# EAGLE design final (EAGLE 9.2.2)
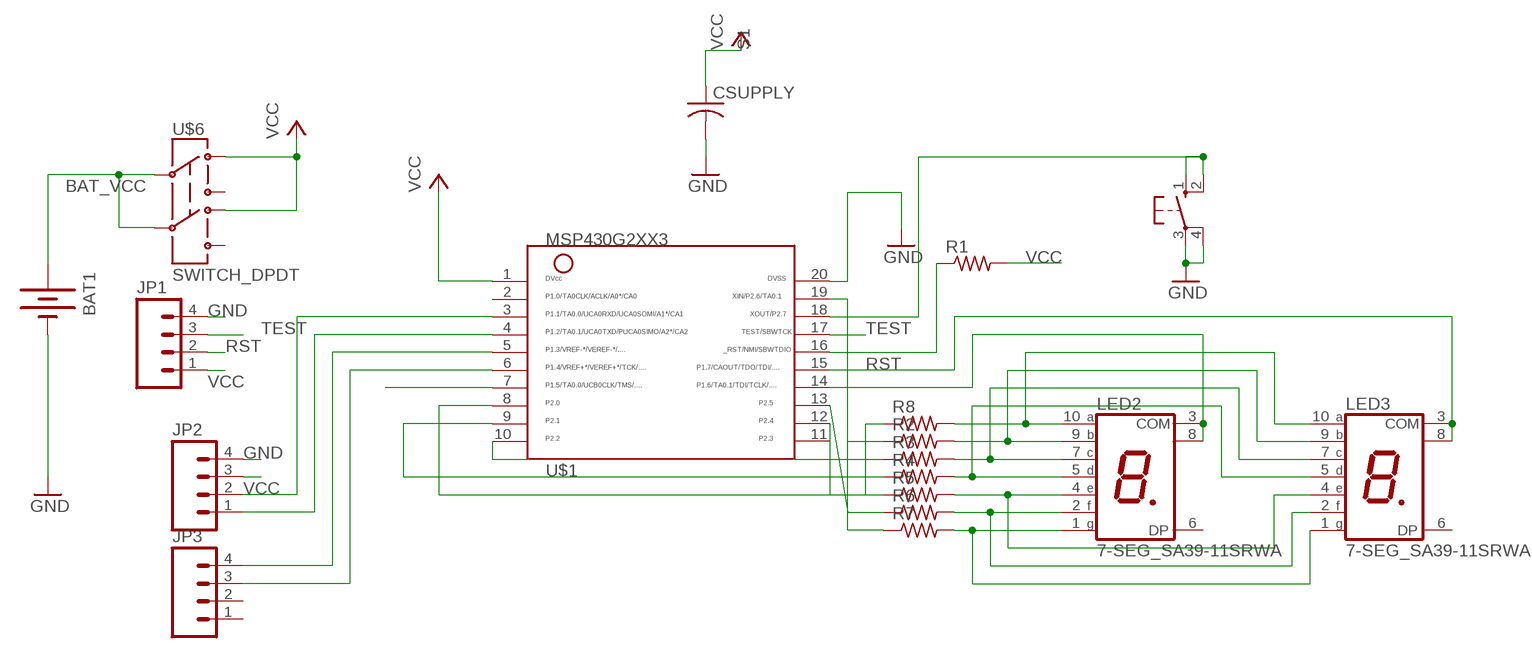
[diagram p0: schematic, sheet 1]

## Parts
BAT1  BATTERYBU2032SM  [BU2032SM]
CSUPPLY  C-USC1206  [C1206]
JP1  M04LOCK  [1X04_LOCK]
JP2  M04LOCK  [1X04_LOCK]
JP3  M04LOCK  [1X04_LOCK]
LED2  7-SEG_SA39-11SRWA  [SA39-11SRWA]
LED3  7-SEG_SA39-11SRWA  [SA39-11SRWA]
R1  R-US_R1206  [R1206]
R2  R-US_R1206  [R1206]
R3  R-US_R1206  [R1206]
R4  R-US_R1206  [R1206]
R5  R-US_R1206  [R1206]
R6  R-US_R1206  [R1206]
R7  R-US_R1206  [R1206]
R8  R-US_R1206  [R1206]
S1  10-XX  [B3F-10XX]
U$1  MSP430G2XX3TSSOP  [PW20]
U$6  SWITCH_DPDT  [JS_DPDT_TH]

## Nets
BAT_VCC: BAT1.P$1(+) U$6.2 U$6.5
GND: BAT1.P$2(-) CSUPPLY.2 JP1.4 JP2.4 S1.3(P) S1.4(P1) U$1.20
N$1: JP3.4 U$1.5
N$2: R8.1 U$1.8
N$5: R2.1 U$1.9
N$6: R3.1 U$1.10
N$7: R4.1 U$1.11
N$8: R5.1 U$1.12
N$9: R6.1 U$1.13
N$10: R7.1 U$1.19
N$11: LED2.3(COM) LED2.8(COM) U$1.14
N$12: LED2.10(A) LED3.10(A) R8.2
N$13: S1.1(S) S1.2(S1) U$1.18
N$14: LED2.9(B) LED3.9(B) R2.2
N$15: LED2.7(C) LED3.7(C) R3.2
N$16: LED2.5(D) LED3.5(D) R4.2
N$17: LED2.4(E) LED3.4(E) R5.2
N$18: LED2.2(F) LED3.2(F) R6.2
N$19: LED2.1(G) LED3.1(G) R7.2
N$20: LED3.3(COM) LED3.8(COM) U$1.15
N$27: JP2.2 U$1.3
N$28: JP2.1 U$1.4
N$29: JP3.3 U$1.6
N$31: U$1.7
RST: JP1.2 R1.1 U$1.16
TEST: JP1.3 U$1.17
VCC: CSUPPLY.1 JP1.1 JP2.3 R1.2 U$1.1 U$6.1 U$6.4
Unconnected: JP3.1 JP3.2 LED2.6(DP) LED3.6(DP) U$1.2 U$6.3 U$6.6

## Library data of the parts
BAT1 = ELEC327:BATTERY: Battery Holders Various common sizes : AA, AAA, 20mm coin cell and 12mm coin cell. 20MM_4LEGS, BATT-10373
CSUPPLY = rcl:C-US: CAPACITOR, American symbol
JP1-JP3 = SparkFun:M04: Header 4 Standard 4-pin 0.1" header. Use with straight break away headers (SKU : PRT-00116), right angle break away headers (PRT-00553), swiss pins (PRT-00743), machine pins (PRT-00117), and female headers (PRT-00115). Molex polarized connector foot print use with SKU : PRT-08231 with associated crimp pins and housings. 1MM SMD Version SKU: PRT-10208
LED2 LED3 = display-kingbright:7-SEG_: Kingbright 14.2mm (0.56 INCH) SINGLE DIGIT NUMERIC DUISPLAY Source: SA56-11EWA(Ver1189471036.pdf; OC_FARNELL: unknown; OC_NEWARK: unknown
R1-R8 = resistor:R-US_: RESISTOR, American symbol
S1 = switch-omron:10-XX: OMRON SWITCH; MPN: B3F-1000; OC_FARNELL: 176432; OC_NEWARK: 36M3542
U$1 = ELEC327:MSP430G2XX3: MSP430G2XX3 PDIP (N) 20 Pin Package
U$6 = ELEC327:SWITCH_DPDT

## Board
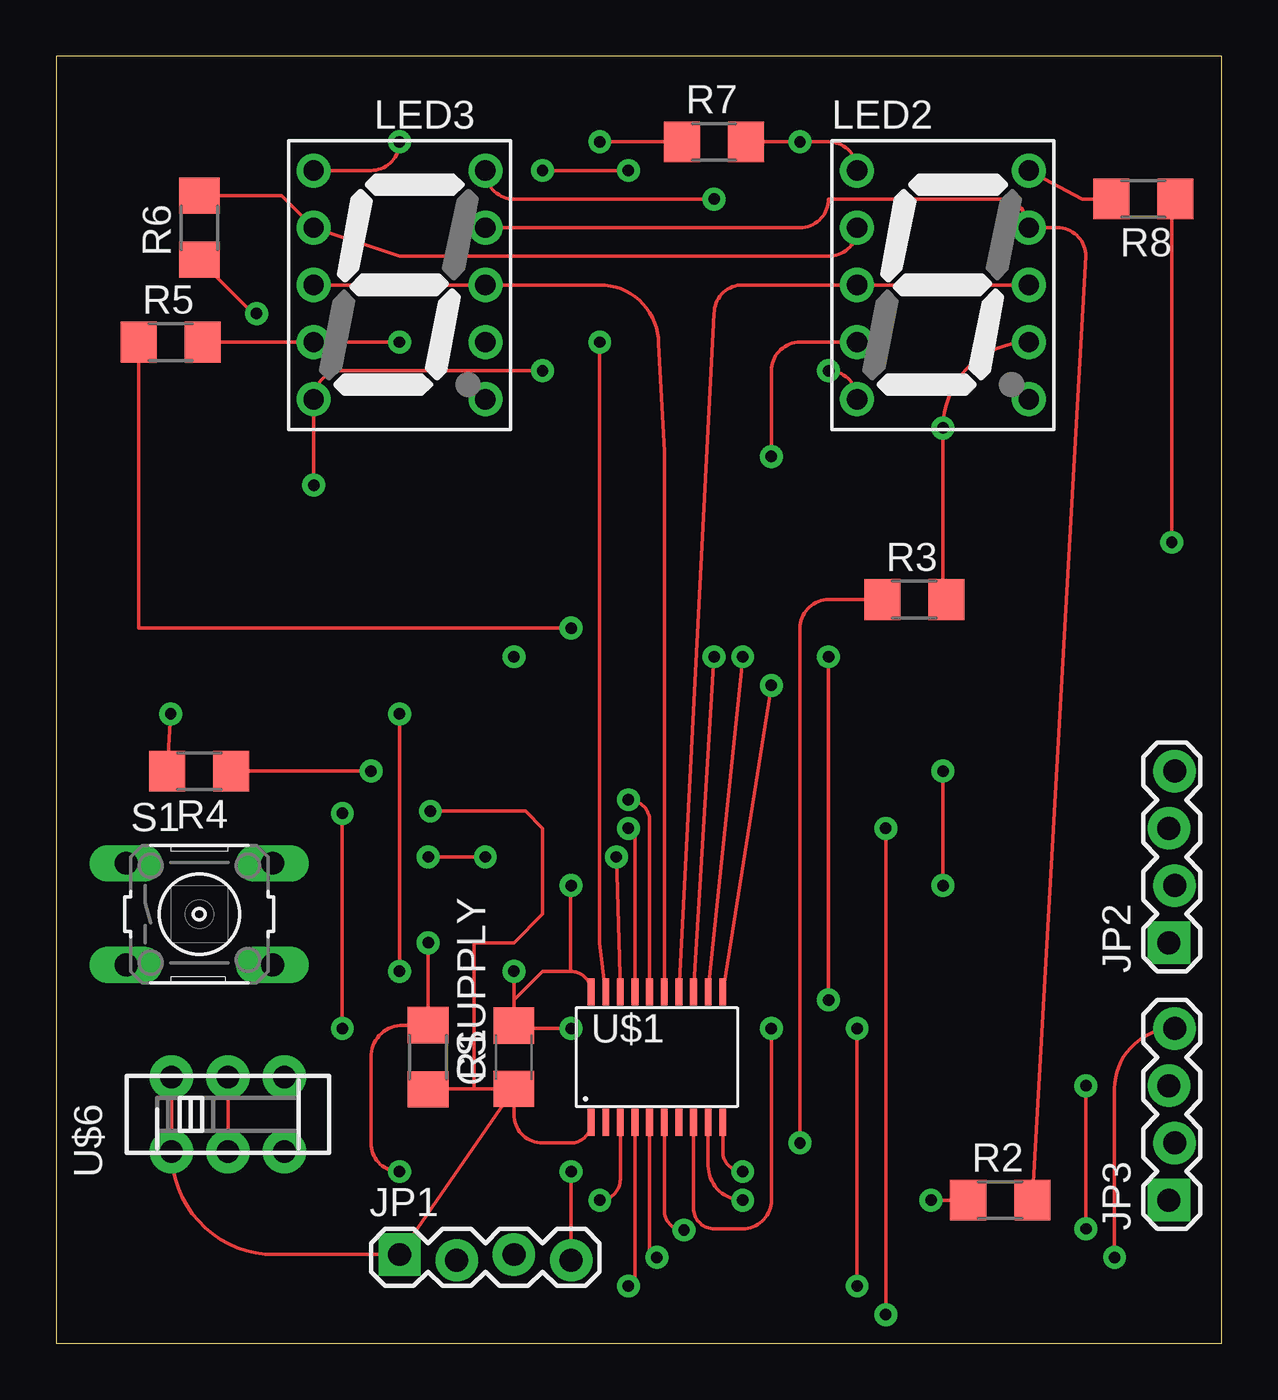
[diagram p1: board, top side]
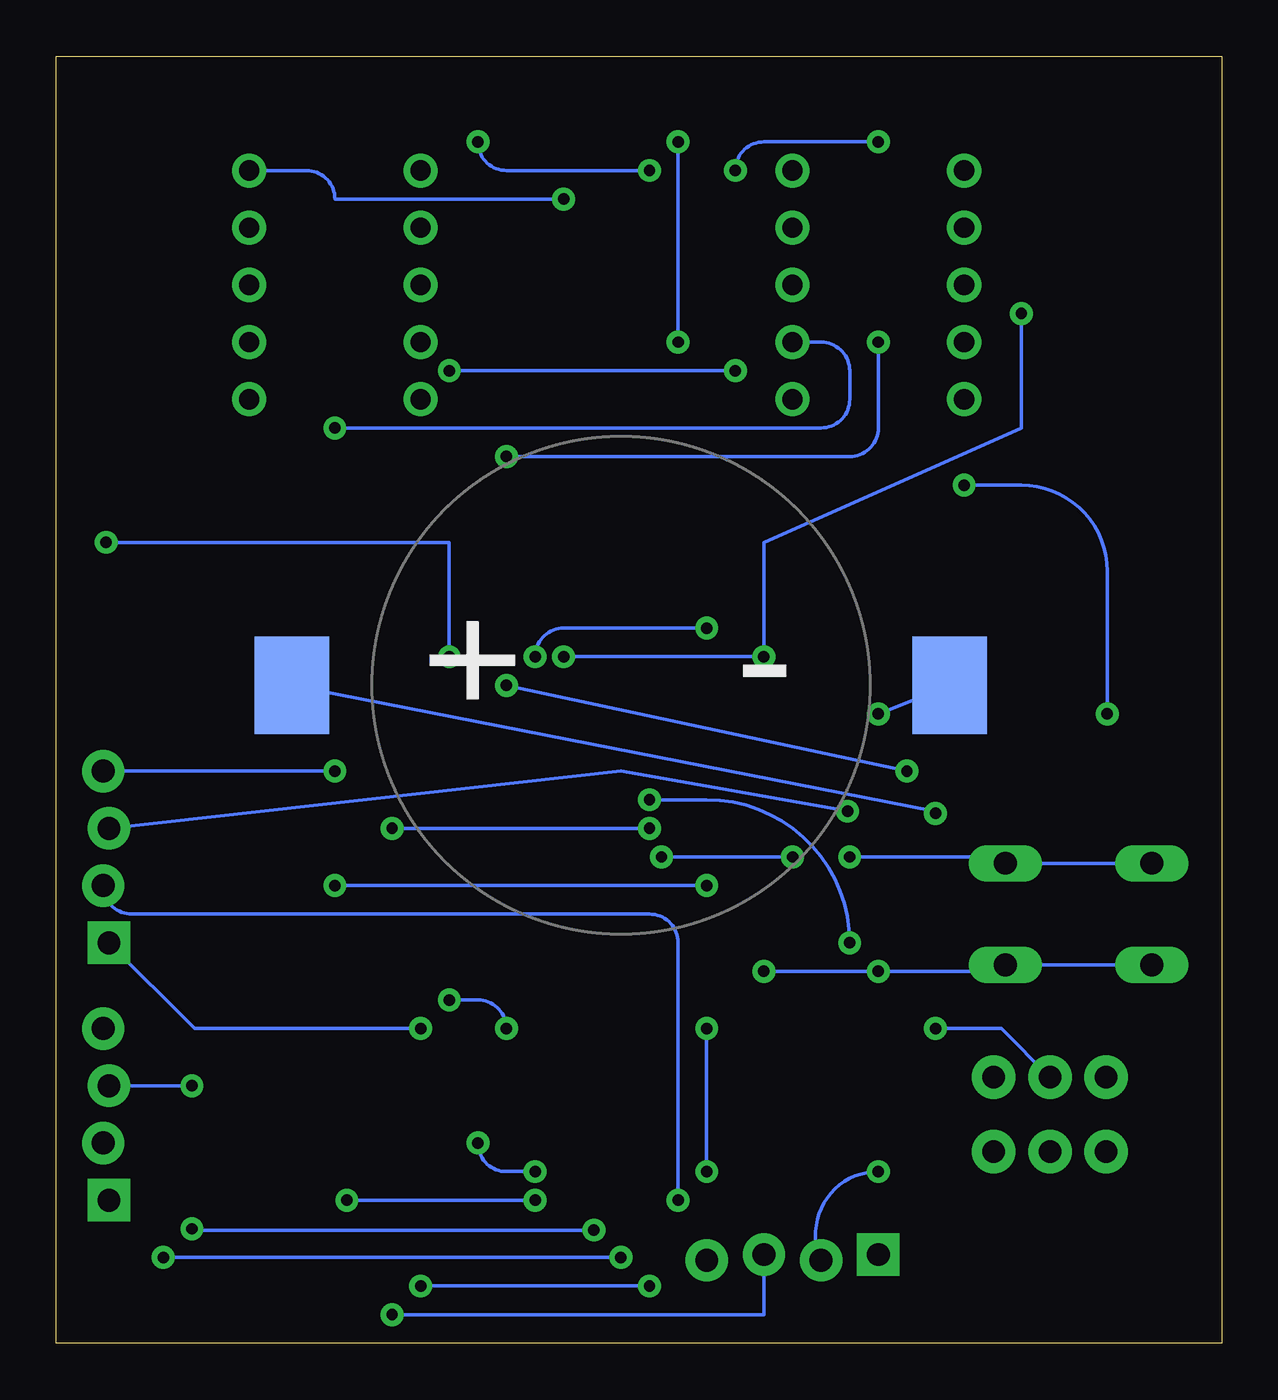
[diagram p2: board, bottom side, seen from below]

Size 51.74 x 57.14 mm. Coordinates in mm from the lower left corner, seen from the top.
Outline: 0,0 51.74,0 51.74,57.14 0,57.14 0,0
Copper layers (1*16): Top 0.035mm / dielectric 1.5mm / Bottom 0.035mm
Design rules "AdvancedCircuitsBarebones": minimum track width 6mil, minimum drill 20mil, track to track 6mil, track to pad 6mil, pad to pad 6mil, via to via 6mil, smd to smd 6mil, copper to edge 10mil, drill to drill 6mil, minimum pad ring 12mil, minimum via ring 10mil, stop-mask expansion 4mil, vias tented up to drill 25mil, thermal gap 10mil

### Footprints (pad centres in the part's own frame; a part is rotated, then mirrored left to right if it is on the bottom)
BU2032SM = smd 3.302 x 4.318: P$1 -14.605,0; P$2 14.605,0
C1206 = smd 1.6 x 1.8: 1 -1.4,0; 2 1.4,0
1X04_LOCK = drill 1.016 pad 1.88 square: 1 0,0.127 | drill 1.016 pad 1.88: 2 2.54,-0.127; 3 5.08,0.127; 4 7.62,-0.127
SA39-11SRWA = drill 0.9 pad 1.5: 1 -3.81,5.08; 2 -3.81,2.54; 3 -3.81,0; 4 -3.81,-2.54; 5 -3.81,-5.08; 6 3.81,-5.08; 7 3.81,-2.54; 8 3.81,0; 9 3.81,2.54; 10 3.81,5.08
R1206 = smd 1.6 x 1.803: 1 -1.422,0; 2 1.422,0
B3F-10XX = drill 1.016 long: 1 -3.251,2.261; 2 3.251,2.261; 3 -3.251,-2.261; 4 3.251,-2.261
PW20 = smd 0.3 x 1.2: 1 -2.925,-2.9; 2 -2.275,-2.9; 3 -1.625,-2.9; 4 -0.975,-2.9; 5 -0.325,-2.9; 6 0.325,-2.9; 7 0.975,-2.9; 8 1.625,-2.9; 9 2.275,-2.9; 10 2.925,-2.9; 11 2.925,2.9; 12 2.275,2.9; 13 1.625,2.9; 14 0.975,2.9; 15 0.325,2.9; 16 -0.325,2.9; 17 -0.975,2.9; 18 -1.625,2.9; 19 -2.275,2.9; 20 -2.925,2.9
JS_DPDT_TH = drill 1 pad 1.93: 1 -2.5,-1.65; 2 0,-1.65; 3 2.5,-1.65; 4 -2.5,1.65; 5 0,1.65; 6 2.5,1.65

### Placement (x,y rotation side)
BAT1  26.67,29.21 0 bottom
CSUPPLY  20.32,12.7 90 top
JP1  15.24,3.81 0 top
JP2  49.53,17.78 90 top
JP3  49.53,6.35 90 top
LED2  39.37,46.99 0 top
LED3  15.24,46.99 0 top
R1  16.51,12.7 270 top
R2  41.91,6.35 0 top
R3  38.1,33.02 0 top
R4  6.35,25.4 180 top
R5  5.08,44.45 0 top
R6  6.35,49.53 90 top
R7  29.21,53.34 0 top
R8  48.26,50.8 180 top
S1  6.35,19.05 0 top
U$1  26.67,12.7 0 top
U$6  7.62,10.16 0 top

### Tracks (layer width: path | path; a pad name or v marks a point on that pad's centre or on a via)
BAT_VCC  (via drill 0.51)
  Top 0.152: U$6.2 U$6.5 | v12.7,23.53 v12.7,13.97
  Bottom 0.152: BAT1.P$1 12.8,23.63 arc90 v12.7,23.53 | v12.7,13.97 9.78,13.97 U$6.5
GND  (via drill 0.51)
  Top 0.152: 20.32,15.24 CSUPPLY.2 arc90 20.45,13.97 v22.86,13.97 | 20.32,15.24 21.59,16.51 22.84,16.51 | 22.84,16.51 arc-90 U$1.20 | JP1.4 v22.86,7.62 | 20.32,15.24 v20.32,16.51 | v15.24,27.94 v15.24,16.51 | 22.84,16.51 22.84,20.29 arc-90 v22.86,20.32 | v39.37,20.32 v39.37,25.4
  Bottom 0.152: BAT1.P$2 v15.24,27.94 | v22.86,7.62 v22.86,13.97 | v20.32,16.51 v15.24,16.51 9.88,16.51 arc90 S1.4 S1.3 | v22.86,20.32 v39.37,20.32 | v39.37,25.4 JP2.4
N$1  (via drill 0.51)
  Top 0.152: U$1.5 26.35,4.13 arc90 v26.67,3.81 | v46.99,3.81 46.99,11.3 arc-90 JP3.4
  Bottom 0.152: v26.67,3.81 v46.99,3.81
N$2  (via drill 0.51)
  Top 0.152: U$1.8 28.3,6 arc90 29.21,5.08 30.48,5.08 arc90 31.75,6.35 v31.75,13.97 | v34.29,15.24 v34.29,30.48 | v49.53,35.56 49.53,50.65 arc-90 R8.1
  Bottom 0.152: v31.75,13.97 arc-90 33.02,15.24 v34.29,15.24 | v34.29,30.48 34.29,35.56 v49.53,35.56
N$5  (via drill 0.51)
  Top 0.152: U$1.9 28.95,7.89 arc90 v30.48,6.35 | R2.1 v38.84,6.35
  Bottom 0.152: v38.84,6.35 v30.48,6.35
N$6  (via drill 0.51)
  Top 0.152: U$1.10 29.59,8.5 arc90 v30.48,7.62 | v33.02,8.89 33.02,31.75 arc-90 34.29,33.02 R3.1
  Bottom 0.152: v30.48,7.62 31.75,7.62 arc90 v33.02,8.89
N$7  (via drill 0.51)
  Top 0.152: v31.75,29.21 U$1.11 | R4.1 v13.97,25.4
  Bottom 0.152: v13.97,25.4 v31.75,29.21
N$8  (via drill 0.51)
  Top 0.152: R5.1 3.66,31.75 v22.86,31.75 | U$1.12 v30.48,30.48
  Bottom 0.152: v22.86,31.75 29.21,31.75 arc-90 v30.48,30.48
N$9  (via drill 0.51)
  Top 0.152: U$1.13 v29.21,30.48 | R6.1 8.74,45.72 v8.89,45.72
  Bottom 0.152: v29.21,30.48 v20.32,30.48 20.32,35.56 8.89,40.64 v8.89,45.72
N$10  (via drill 0.51)
  Top 0.152: U$1.19 24.13,17.78 24.13,21.59 v24.13,44.45 | v24.13,53.34 R7.1
  Bottom 0.152: v24.13,53.34 v24.13,44.45
N$11
  Top 0.152: LED2.8 LED2.3 30.48,46.99 arc90 29.21,45.72 U$1.14
N$12  (via drill 0.51)
  Top 0.152: v29.21,50.8 20.32,50.8 arc-90 LED3.10 | R8.2 45.57,50.8 LED2.10
  Bottom 0.152: LED2.10 40.64,52.07 arc90 39.37,50.8 v29.21,50.8
N$13  (via drill 0.51)
  Top 0.152: U$1.18 v24.87,21.59 | v19.05,21.59 v16.51,21.59
  Bottom 0.152: v24.87,21.59 v19.05,21.59 | v16.51,21.59 9.88,21.59 arc90 S1.2 S1.1
N$14
  Top 0.152: LED3.9 33.02,49.53 arc90 34.29,50.8 41.91,50.8 arc-90 LED2.9 44.45,49.53 arc-90 45.72,48.26 R2.2
N$15  (via drill 0.51)
  Top 0.152: R3.2 arc-90 39.37,33.17 v39.37,40.64 arc-90 LED2.7
  Bottom 0.152: LED3.7 17.78,44.45 arc90 16.51,43.18 16.51,41.91 arc90 17.78,40.64 v39.37,40.64
N$16  (via drill 0.51)
  Top 0.152: v11.43,38.1 LED3.5 arc-90 12.7,43.18 v21.59,43.18 | v34.29,43.18 arc-90 LED2.5 | R4.2 v5.08,27.94
  Bottom 0.152: v11.43,38.1 8.89,38.1 arc90 5.08,34.29 v5.08,27.94 | v21.59,43.18 v34.29,43.18
N$17  (via drill 0.51)
  Top 0.152: R5.2 LED3.4 v15.24,44.45 | v31.75,39.37 31.75,43.18 arc-90 33.02,44.45 LED2.4
  Bottom 0.152: v15.24,44.45 15.24,40.64 arc90 16.51,39.37 v31.75,39.37
N$18
  Top 0.152: LED2.2 arc-90 34.29,48.26 15.24,48.26 LED3.2 10.01,50.95 R6.2
N$19  (via drill 0.51)
  Top 0.152: R7.2 v33.02,53.34 34.29,53.34 arc-90 LED2.1 | LED3.1 13.97,52.07 arc90 v15.24,53.34 | v21.59,52.07 v25.4,52.07
  Bottom 0.152: v15.24,53.34 20.32,53.34 arc-90 v21.59,52.07 | v25.4,52.07 31.75,52.07 arc90 v33.02,53.34
N$20
  Top 0.152: LED3.3 LED3.8 24.13,46.99 arc-90 26.74,44.38 27,39.58 U$1.15
N$27  (via drill 0.51)
  Top 0.152: U$1.3 25.05,7.27 arc-90 v24.13,6.35
  Bottom 0.152: v24.13,6.35 24.13,17.78 arc-90 25.4,19.05 48.39,19.05 arc90 JP2.2
N$28  (via drill 0.51)
  Top 0.152: U$1.4 25.7,2.83 arc90 v25.4,2.54 | v35.56,13.97 v35.56,2.54
  Bottom 0.152: v25.4,2.54 v35.56,2.54 | v35.56,13.97 45.59,13.97 JP2.1
N$29  (via drill 0.51)
  Top 0.152: U$1.6 27,5.9 arc90 v27.87,5.02 | v45.72,5.08 v45.72,11.43
  Bottom 0.152: v27.87,5.02 45.66,5.02 arc90 v45.72,5.08 | v45.72,11.43 JP3.3
RST  (via drill 0.51)
  Top 0.152: v16.51,17.78 R1.1 15.39,14.12 arc90 13.97,12.7 13.97,8.89 arc90 v15.24,7.62 | U$1.16 26.35,23.18 arc90 v25.4,24.13
  Bottom 0.152: v25.4,24.13 22.86,24.13 arc90 v16.51,17.78 | v15.24,7.62 arc-114 JP1.2
TEST  (via drill 0.51)
  Top 0.152: v36.83,22.86 v36.83,1.27 | U$1.17 25.7,22.57 arc90 v25.4,22.86
  Bottom 0.152: v36.83,1.27 20.32,1.27 JP1.3 | v25.4,22.86 v36.83,22.86
VCC  (via drill 0.51)
  Top 0.152: CSUPPLY.1 20.32,10.16 arc90 21.59,8.89 22.84,8.89 arc90 U$1.1 | U$6.4 U$6.1 arc90 9.69,3.94 JP1.1 CSUPPLY.1 | 18.54,11.3 16.53,11.3 R1.2 | 18.54,11.3 CSUPPLY.1 | v16.61,23.62 20.83,23.62 21.59,22.86 21.59,19.05 20.32,17.78 18.54,17.78 18.54,11.3
  Bottom 0.152: v16.61,23.62 26.67,25.4 JP2.3